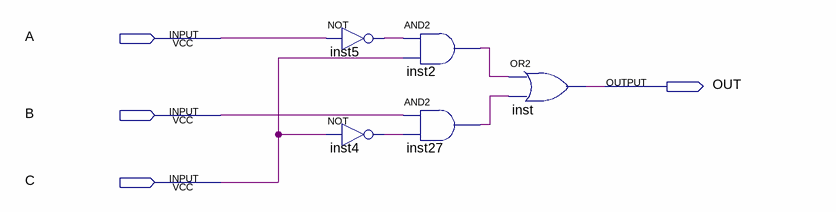
[diagram p0: schematic sheet]
// Quartus schematic ComparatorSIGN.bdf as structural Verilog: 5 symbols, 4 pins
module ComparatorSIGN (
  input  A,
  input  B,
  input  C,
  output OUT
);

  wire inst2_out, inst4_out, inst5_out, inst27_out;

  not inst5 (inst5_out, A);
  not inst4 (inst4_out, C);
  and inst2 (inst2_out, inst5_out, C);
  and inst27 (inst27_out, B, inst4_out);
  or inst (OUT, inst2_out, inst27_out);
endmodule
